# Altium project wifi_esp8266.PrjPcb
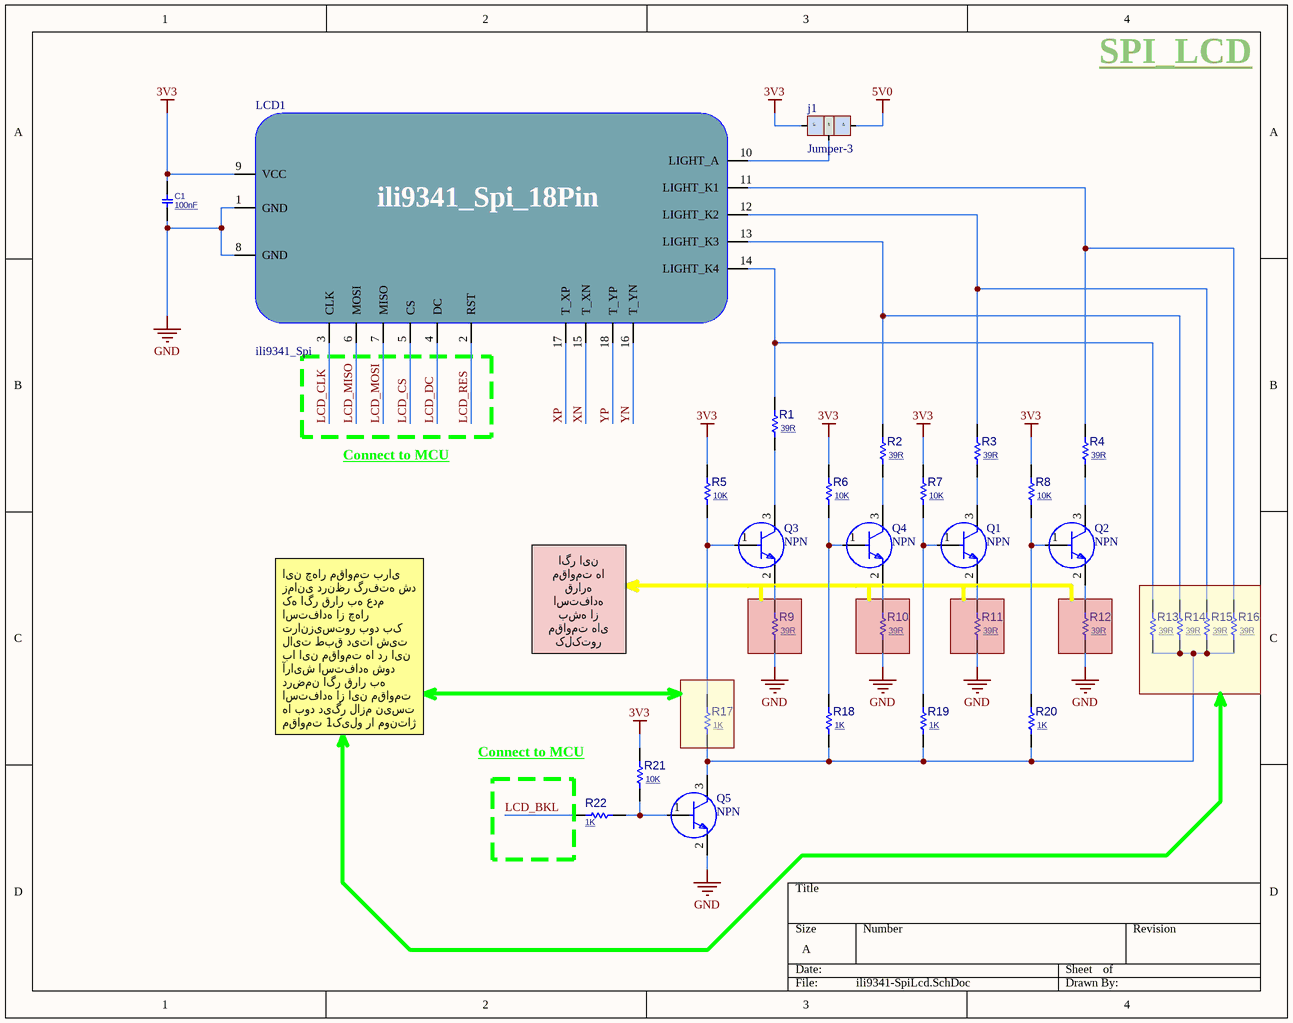
[diagram p0: ili9341-SpiLcd.SchDoc]
12 sheets, 178 parts. Net scope: global (net labels, ports and power ports of the same name join across sheets).
Board file: Stm32F411CEU6-wifi-btn-lcd.PcbDoc
Sheets:
  ili9341-SpiLcd.SchDoc
  Xpt2046.SchDoc
  W25Qxx-SpiFlash.SchDoc
  SDIO_SDcard.SchDoc
  AT24Cxxx_EEPROM_I2C.SchDoc
  ESP8266-12x.SchDoc
  HC-05_BlueTooth.SchDoc
  Key_LED_Buzzer.SchDoc
  Stm32F411CEU6.SchDoc
  Stm32F411CEU6_Property.SchDoc
  AMS1117-3.3V.SchDoc
  PCF8547.SchDoc

## Sheet ili9341-SpiLcd.SchDoc
size A; SheetNumber: 1; SheetTotal: 12

### Parts
C1  100nF  [C0603]
j1  Jumper-3  [jumper-3]
LCD1  ili9341_Spi  [ILI9341_Spi_18Pin_2]
Q1  NPN  [FP-SOT23-IPC_A]
Q2  NPN  [FP-SOT23-IPC_A]
Q3  NPN  [FP-SOT23-IPC_A]
Q4  NPN  [FP-SOT23-IPC_A]
Q5  NPN  [FP-SOT23-IPC_A]
R1  39R  [R0603]
R2  39R  [R0603]
R3  39R  [R0603]
R4  39R  [R0603]
R5  10K  [R0603]
R6  10K  [R0603]
R7  10K  [R0603]
R8  10K  [R0603]
R9  39R  [R0603]
R10  39R  [R0603]
R11  39R  [R0603]
R12  39R  [R0603]
R13  39R  [R0603]
R14  39R  [R0603]
R15  39R  [R0603]
R16  39R  [R0603]
R17  1K  [R0603]
R18  1K  [R0603]
R19  1K  [R0603]
R20  1K  [R0603]
R21  10K  [R0603]
R22  1K  [R0603]

### Nets
3V3: C1.2 j1.3 LCD1.9(VCC) R5.2 R6.2 R7.2 R8.2 R21.2
5V0: j1.1
GND: C1.1 LCD1.1(GND) LCD1.8(GND) Q5.2(E) R9.1 R10.1 R11.1 R12.1
LCD_BKL: R22.2
LCD_CLK: LCD1.3(CLK)
LCD_CS: LCD1.5(CS)
LCD_DC: LCD1.4(DC)
LCD_MISO: LCD1.6(MOSI)
LCD_MOSI: LCD1.7(MISO)
LCD_RES: LCD1.2(RST)
XN: LCD1.15(T_XN)
XP: LCD1.17(T_XP)
YN: LCD1.16(T_YN)
YP: LCD1.18(T_YP)
Netj1_2: j1.2 LCD1.10(LIGHT_A)
NetLCD1_11: LCD1.11(LIGHT_K1) R4.2 R16.2
NetLCD1_12: LCD1.12(LIGHT_K2) R3.2 R15.2
NetLCD1_13: LCD1.13(LIGHT_K3) R2.2 R14.2
NetLCD1_14: LCD1.14(LIGHT_K4) R1.2 R13.2
NetQ1_1: Q1.1(B) R7.1 R19.2
NetQ1_2: Q1.2(E) R11.2
NetQ1_3: Q1.3(C) R3.1
NetQ2_1: Q2.1(B) R8.1 R20.2
NetQ2_2: Q2.2(E) R12.2
NetQ2_3: Q2.3(C) R4.1
NetQ3_1: Q3.1(B) R5.1 R17.2
NetQ3_2: Q3.2(E) R9.2
NetQ3_3: Q3.3(C) R1.1
NetQ4_1: Q4.1(B) R6.1 R18.2
NetQ4_2: Q4.2(E) R10.2
NetQ4_3: Q4.3(C) R2.1
NetQ5_1: Q5.1(B) R21.1 R22.1
NetQ5_3: Q5.3(C) R13.1 R14.1 R15.1 R16.1 R17.1 R18.1 R19.1 R20.1

### Notes on the sheet
- SPI_LCD
- Connect to MCU
- اگر این مقاومت ها قراره استفاده بشه از مقاومت های کلکتور استفاده نمیکنیم
- این چهار مقاومت برای زمانی درنظر گرفته شد که اگر قرار به عدم استفاده از چهار ترانزیستور بود بک لایت طبق دیتا شیت با این مقاومت ها در این آرایش استفاده شود
  درضمن اگر قرار به استفاده از این مقاومت ها بود دیگر لازم نیست مقاومت 1کیلو را مونتاژ کرد
- (in symbol ili9341_Spi) ili9341_Spi_18Pin
- (in symbol Jumper-3) C; B; A

### Library data of the parts
C1 = CAP_SMD_MLCC_0603: CAP, MLCC, -F, -V, MATERIAL, -%, 0201; PARAM: -, -%; MANF_P#: MANF_PART#; PRICE: 100= 1$; MANF: -; PARAM2: -V; ASSEMBLY: ASSEMBLY; VALUE: 100nF
Q1-Q5 = CMP-2000-04931-2: Frequency: 300MHz; Collector Emitter Voltage (VCEO): 40V; Power Dissipation: 350mW; Element Configuration: Single; Max Power Dissipation: 300mW; Max Collector Current: 200mA; Collector Emitter Saturation Voltage: 300mV; Number of Elements: 1; hFE Min: 100; Collector Base Voltage (VCBO): 60V; Emitter Base Voltage (VEBO): 6V; Contact Plating: Tin; Package Quantity: 3000; Max Frequency: 300MHz; REACH SVHC: No SVHC; Max Operating Temperature: 150°C; Width: 1.4mm; Voltage Rating (DC): 40V; Radiation Hardening: No; Case/Package: SOT-23; Height: 1mm; Collector Emitter Breakdown Voltage: 40V; Length: 3.05mm; Polarity: NPN; Packaging: Tape and Reel; Number of Pins: 3; Min Operating Temperature: -55°C; Gain Bandwidth Product: 300MHz; Mount: Surface Mount; Weight: 0.000282oz; Continuous Collector Current: 200mA; Transition Frequency: 300MHz; Max Breakdown Voltage: 40V; Lead Free: Lead Free
R1-R22 = RES_SMD: RESISTOR, SMD; PARAM: -W; DESC: DESCRIPTION; DIST#: MOUSER; PARAM2: 1%; MANF_P#: -; MANF: -; ASSEMBLY: ASSEMBLY; PRICE: 100= 0.5$
  R1-R4 R9-R16: VALUE: 39R
  R5-R8 R21: VALUE: 10K
  R17-R20 R22: VALUE: 1K

## Sheet Xpt2046.SchDoc
size A; SheetNumber: 2; SheetTotal: 12
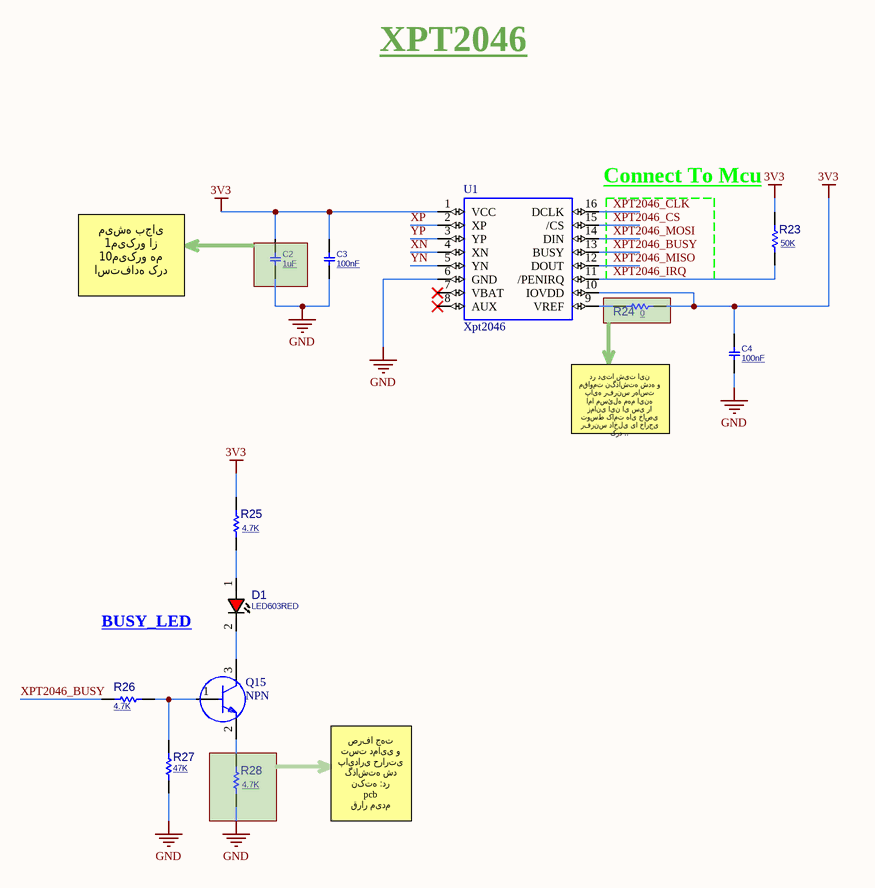
[diagram p1: Xpt2046.SchDoc]

### Parts
C2  1uF  [C1206]
C3  100nF  [C0603]
C4  100nF  [C0603]
D1  LED603RED  [LED0603RED]
Q15  NPN  [FP-SOT23-IPC_A]
R23  50K  [R0603]
R24  0  [R0603]
R25  4.7K  [R0603]
R26  4.7K  [R0603]
R27  47K  [R0603]
R28  4.7K  [R0603]
U1  Xpt2046  [Xpt2046]

### Nets
3V3: C2.2 C3.2 C4.2 R23.2 R24.1 R25.2 U1.1(VCC) U1.10(IOVDD)
GND: C2.1 C3.1 C4.1 R27.2 R28.1 U1.6(GND)
XN: U1.4(XN)
XP: U1.2(XP)
XPT2046_BUSY: R26.2 U1.13(BUSY)
XPT2046_CLK: U1.16(DCLK)  [project net W25Q_CLK]
XPT2046_CS: U1.15(/CS)
XPT2046_IRQ: R23.1 U1.11(/PENIRQ)
XPT2046_MISO: U1.12(DOUT)  [project net W25Q_MISO]
XPT2046_MOSI: U1.14(DIN)  [project net W25Q_MOSI]
YN: U1.5(YN)
YP: U1.3(YP)
NetD1_1: D1.1(ANODE) R25.1
NetD1_2: D1.2(CATHODE) Q15.3(C)
NetQ15_1: Q15.1(B) R26.1 R27.1
NetQ15_2: Q15.2(E) R28.2
NetR24_2: R24.2 U1.9(VREF)

Not connected (* = marked no-connect by the designer): U1 7(VBAT)* 8(AUX)*

### Notes on the sheet
- XPT2046
- Connect To Mcu
- میشه بجای 1میکرو از 10میکرو هم استفاده کرد
- در دیتا شیت این مقاومت نگذاشته شده و پایه رفرنس رهاست
  اما مسئله مهم اینه زمانی این ای سی را توسط کامت های خاصی رفرنس داخلی یا خارجی کرد ..
- BUSY_LED
- صرفا جهت تست دمایی و پایداری حرارتی گذاشته شد نکته :در
  pcb
  قرار میدم

### Library data of the parts
C2 = CAP_SMD_MLCC_1206: CAP, MLCC, -F, -V, MATERIAL, -%, 0201; PARAM: -, -%; MANF_P#: MANF_PART#; PRICE: 100= 1$; MANF: -; PARAM2: -V; ASSEMBLY: ASSEMBLY; VALUE: 1uF
C3 C4 = CAP_SMD_MLCC_0603: as C1 on sheet ili9341-SpiLcd; PRICE: 100= 1$; MANF: -; PARAM2: -V; ASSEMBLY: ASSEMBLY; VALUE: 100nF
D1 = LED_SMD_0603_RED: LED, SMD, 0603, RED; PARAM: 30mA, 640nm; DESC: DESCRIPTION; MANF_P#: MANF_PART#; PARAM2: 1.8~2.5V; MANF: MANF; ASSEMBLY: ASSEMBLY; PRICE: PRICE; VALUE: LED603RED
Q15 = CMP-2000-04931-2: as Q1 on sheet ili9341-SpiLcd; Contact Plating: Tin; Package Quantity: 3000; Max Frequency: 300MHz; REACH SVHC: No SVHC; Max Operating Temperature: 150°C; Width: 1.4mm; Voltage Rating (DC): 40V; Radiation Hardening: No; Case/Package: SOT-23; Height: 1mm; Collector Emitter Breakdown Voltage: 40V; Length: 3.05mm; Polarity: NPN; Packaging: Tape and Reel; Number of Pins: 3; Min Operating Temperature: -55°C; Gain Bandwidth Product: 300MHz; Mount: Surface Mount; Weight: 0.000282oz; Continuous Collector Current: 200mA; Transition Frequency: 300MHz; Max Breakdown Voltage: 40V; Lead Free: Lead Free
R23-R28 = RES_SMD: as R1 on sheet ili9341-SpiLcd; MANF_P#: -; MANF: -; ASSEMBLY: ASSEMBLY; PRICE: 100= 0.5$
  R23: VALUE: 50K
  R24: VALUE: 0
  R25 R26 R28: VALUE: 4.7K
  R27: VALUE: 47K

## Sheet W25Qxx-SpiFlash.SchDoc
size A; SheetNumber: 3; SheetTotal: 12
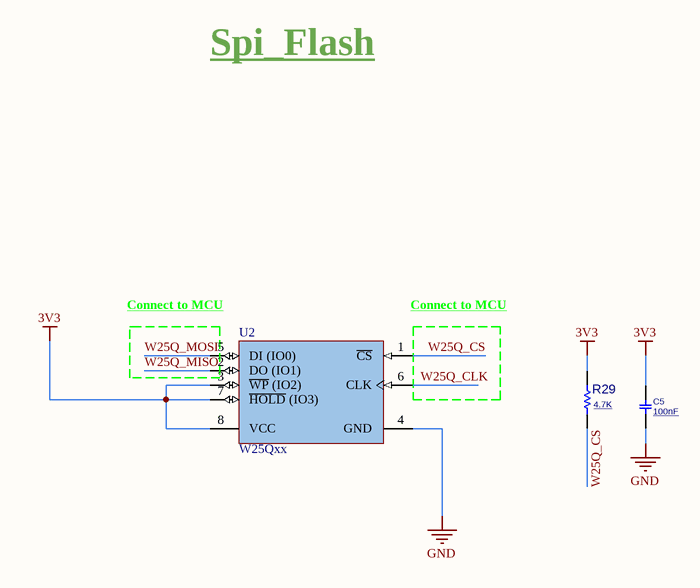
[diagram p2: W25Qxx-SpiFlash.SchDoc]

### Parts
C5  100nF  [C0603]
R29  4.7K  [R0603]
U2  W25Qxx  [WINB-SOIC-8_M]

### Nets
3V3: C5.2 R29.2 U2.3(~{WP}_(IO2)) U2.7(~{HOLD}_(IO3)) U2.8(VCC)
GND: C5.1 U2.4(GND)
W25Q_CLK: U2.6(CLK)
W25Q_CS: R29.1 U2.1(~{CS})
W25Q_MISO: U2.2(DO_(IO1))
W25Q_MOSI: U2.5(DI_(IO0))

### Notes on the sheet
- Spi_Flash
- (near U2) Connect to MCU

### Library data of the parts
C5 = CAP_SMD_MLCC_0603: as C1 on sheet ili9341-SpiLcd; PRICE: 100= 1$; MANF: -; PARAM2: -V; ASSEMBLY: ASSEMBLY; VALUE: 100nF
R29 = RES_SMD: as R1 on sheet ili9341-SpiLcd; MANF_P#: -; MANF: -; ASSEMBLY: ASSEMBLY; PRICE: 100= 0.5$; VALUE: 4.7K
U2 = W25Qxx: Manufacturer: Winbond; Boot Type: Bottom/Top; Word Size: 8b; Cell Type: NOR; Operating Supply Voltage (Min): 2.7V; Operating Supply Voltage (Max): 3.6V; Rad Hardened: No; Density: 67108864Bit; Address Bus: 1b; Supply Current: 40mA; Program/Erase Volt (Typ): 2.7to3.6V; Sync/Async: Synchronous; Number of Words: 8M; Programmable: Yes; Operating Supply Voltage (Typ): 3/3.3V; Access Time (Max): 8.5ns; Interface Type: Serial(SPI); Operating Temperature Classification: Industrial; Datasheet Version: Rev. D, 12/2011; Operating Temp Range: -40Cto85C; Operating Temperature (Max): 85C; Pin Count: 8; Mounting: SurfaceMount; Operating Temperature (Min): -40C; Package Description: 8-Pin Small Outline Integrated Circuit, Body 5.28 x 5.28 mm, Pitch 1.27 mm; Datasheet URL: https://datasheet.ciiva.com/15126/getdatasheetpartid-552937-15126648.pdf; Package Reference: SS-8; Manufacturer URL: http://www.winbond.com/hq/index.html?__locale=en; Package Type: SOIC

## Sheet SDIO_SDcard.SchDoc
size A; SheetNumber: 4; SheetTotal: 12
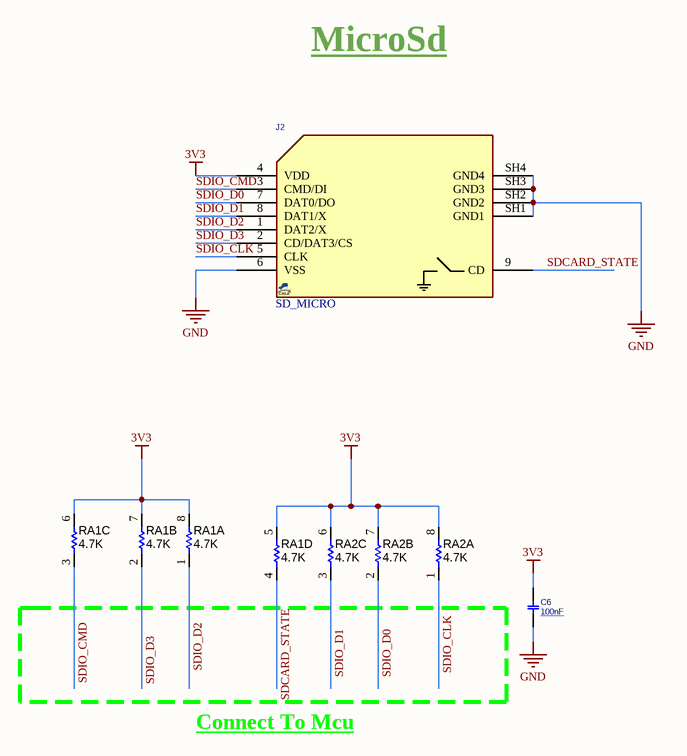
[diagram p3: SDIO_SDcard.SchDoc]

### Parts
C6  100nF  [C0603]
J2  SD_MICRO  [SDMICRO_AT]
RA1  value 4.7K  [RP0603X4]  (hidden comment: Film Res Pack)  (parts A,B,C,D of 4)
RA2  value 4.7K  [RP0603X4]  (hidden comment: Film Res Pack)  (parts A,B,C of 4)

### Nets
3V3: C6.2 J2.4(VDD) RA1.5 RA1.6 RA1.7 RA1.8 RA2.6 RA2.7 RA2.8
GND: C6.1 J2.6(VSS) J2.SH1(GND1) J2.SH2(GND2) J2.SH3(GND3) J2.SH4(GND4)
SDCARD_STATE: J2.9(CD) RA1.4
SDIO_CLK: J2.5(CLK) RA2.1
SDIO_CMD: J2.3(CMD/DI) RA1.3
SDIO_D0: J2.7(DAT0/DO) RA2.2
SDIO_D1: J2.8(DAT1/X) RA2.3
SDIO_D2: J2.1(DAT2/X) RA1.1
SDIO_D3: J2.2(CD/DAT3/CS) RA1.2

### Notes on the sheet
- MicroSd
- Connect To Mcu

### Library data of the parts
C6 = CAP_SMD_MLCC_0603: as C1 on sheet ili9341-SpiLcd; PRICE: 100= 1$; MANF: -; PARAM2: -V; ASSEMBLY: ASSEMBLY; VALUE: 100nF
J2 = SOCKET_SDMICRO_AT: SD MICRO exist in Iran, Attend 112J-TDAR-R01; PARAM: push-push; MANF: Attend; MANF_P#: 112J-TDAR-R01; VALUE: SD_MICRO
RA1 RA2 = RES_SMD_PACK_X4: RESISTOR, SMD, PACKX4; MANF_P#: MANF_PART#; MANF: MANF

## Sheet AT24Cxxx_EEPROM_I2C.SchDoc
size A; SheetNumber: 5; SheetTotal: 12
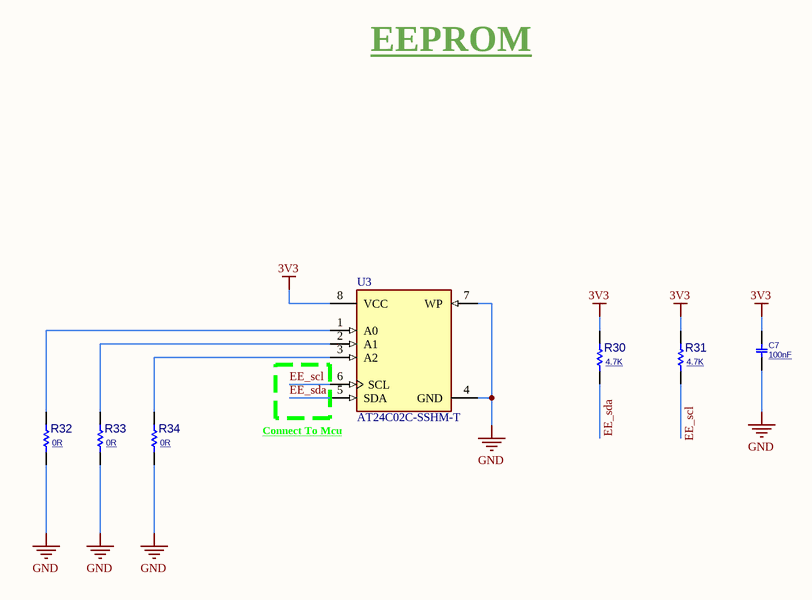
[diagram p4: AT24Cxxx_EEPROM_I2C.SchDoc]

### Parts
C7  100nF  [C0603]
R30  4.7K  [R0603]
R31  4.7K  [R0603]
R32  0R  [R0603]
R33  0R  [R0603]
R34  0R  [R0603]
U3  AT24C02C-SSHM-T  [FP-C04-057-SN-MFG]

### Nets
3V3: C7.2 R30.2 R31.2 U3.8(VCC)
GND: C7.1 R32.1 R33.1 R34.1 U3.4(GND) U3.7(WP)
EE_scl: R31.1 U3.6(SCL)
EE_sda: R30.1 U3.5(SDA)
NetR32_2: R32.2 U3.1(A0)
NetR33_2: R33.2 U3.2(A1)
NetR34_2: R34.2 U3.3(A2)

### Notes on the sheet
- EEPROM
- (near U3) Connect To Mcu

### Library data of the parts
C7 = CAP_SMD_MLCC_0603: as C1 on sheet ili9341-SpiLcd; PRICE: 100= 1$; MANF: -; PARAM2: -V; ASSEMBLY: ASSEMBLY; VALUE: 100nF
R30-R34 = RES_SMD: as R1 on sheet ili9341-SpiLcd; MANF_P#: -; MANF: -; ASSEMBLY: ASSEMBLY; PRICE: 100= 0.5$
  R30 R31: VALUE: 4.7K
  R32-R34: VALUE: 0R
U3 = CMP-06313-000008-1: IC EEPROM 2K I2C 1MHZ 8SOIC; Manufacturer: Microchip; Frequency: 1000kHz; Nominal Supply Current: 0.4-2mA; Min Supply Voltage: 1.7V; Standoff Height: 0.1mm; Access Time: 900ns; Memory Size: 2Kbits; Max Supply Voltage: 5.5V; Interface: I2C,2-Wire; Ipc Land Pattern Name: SOIC127P600X175-8; Octopart: https://octopart.com/at24c02c-sshm-t-microchip-77757935; Footprint Url: http://ww1.microchip.com/downloads/en/DeviceDoc/08L_SOIC_150_3dot9mm_SN_C04-00057e.pdf; Temperature Range High: +85°C; Height: 1.75mm; Package: C04-057-SN; RoHS: TRUE; Mouser Description: EEPROM Serial-2Wire 2K-bit 256 x 8 1.8V/2.5V/3.3V/5V Automotive 8-Pin SOIC T/R; Memory Type: EEPROM; Device Class L3: EEPROM; Device Class L2: Memory; ComponentLink2URL: http://ww1.microchip.com/downloads/en/DeviceDoc/AT24C01C-AT24C02C-I2C-Compatible-Two-Wire-Serial-EEPROM-1Kbit-2Kbit-20006111A.pdf; Digikey Description: IC EEPROM 2K I2C 1MHZ 8SOIC; Category: IC; Temperature: -40°C to +85°C; Lead Free: Yes; Manufacturer Part Number: AT24C02C-SSHM-T; ComponentLink2Description: Datasheet; Temperature Range Low: -40°C; Automotive: No; Device Class L1: Integrated Circuits (ICs)

## Sheet ESP8266-12x.SchDoc
size A4; SheetNumber: 6; SheetTotal: 12
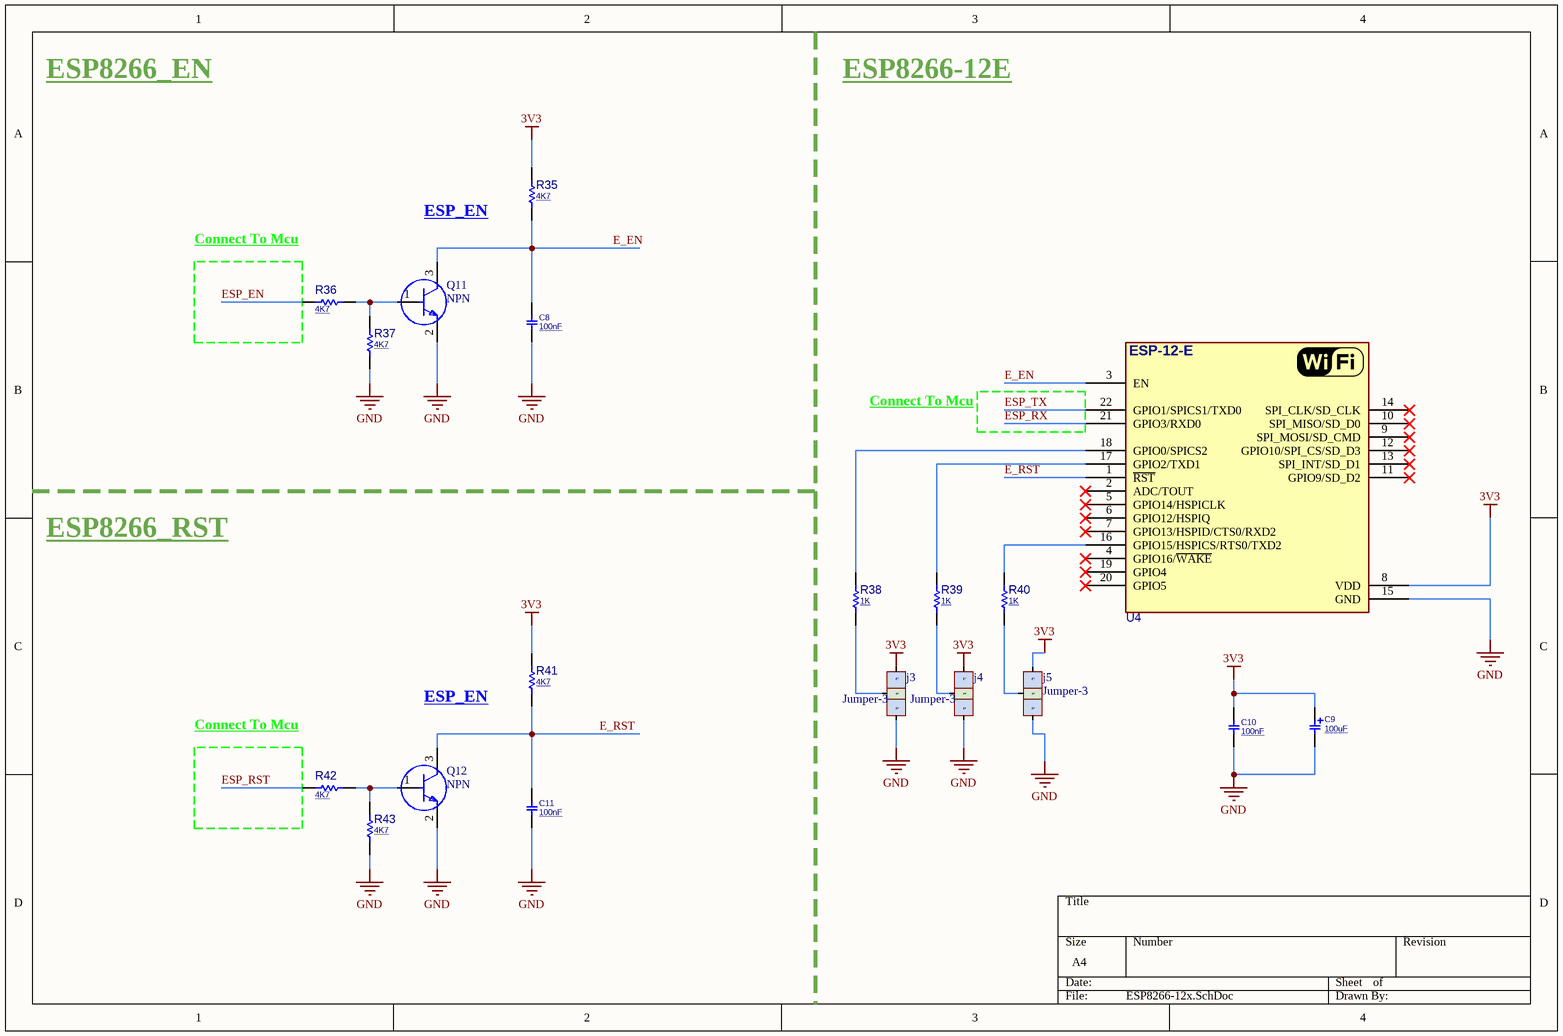
[diagram p5: ESP8266-12x.SchDoc]

### Parts
C8  100nF  [C0603]
C9  value 100uF  [C_TN_3216]  (hidden comment: 4.7uF)
C10  100nF  [C0603]
C11  100nF  [C0603]
j3  Jumper-3  [jumper-3]
j4  Jumper-3  [jumper-3]
j5  Jumper-3  [jumper-3]
Q11  NPN  [FP-SOT23-IPC_A]
Q12  NPN  [FP-SOT23-IPC_A]
R35  4K7  [R0603]
R36  4K7  [R0603]
R37  4K7  [R0603]
R38  1K  [R0603]
R39  1K  [R0603]
R40  1K  [R0603]
R41  4K7  [R0603]
R42  4K7  [R0603]
R43  4K7  [R0603]
U4  (no value)  [ESP8266_ESP12E]

### Nets
3V3: C9.1 C10.2 j3.3 j4.3 j5.3 R35.2 R41.2 U4.8(VDD)
GND: C8.1 C9.2 C10.1 C11.1 j3.1 j4.1 j5.1 Q11.2(E) Q12.2(E) R37.1 R43.1 U4.15(GND)
E_EN: C8.2 Q11.3(C) R35.1 U4.3(EN)
E_RST: C11.2 Q12.3(C) R41.1 U4.1(~{RST})
ESP_EN: R36.1
ESP_RST: R42.1
ESP_RX: U4.21(GPIO3/RXD0)
ESP_TX: U4.22(GPIO1/SPICS1/TXD0)
Netj3_2: j3.2 R38.1
Netj4_2: j4.2 R39.1
Netj5_2: j5.2 R40.1
NetQ11_1: Q11.1(B) R36.2 R37.2
NetQ12_1: Q12.1(B) R42.2 R43.2
NetR38_2: R38.2 U4.18(GPIO0/SPICS2)
NetR39_2: R39.2 U4.17(GPIO2/TXD1)
NetR40_2: R40.2 U4.16(GPIO15/HSPICS/RTS0/TXD2)

Not connected (* = marked no-connect by the designer): U4 2(ADC/TOUT)* 4(GPIO16/~{WAKE})* 5(GPIO14/HSPICLK)* 6(GPIO12/HSPIQ)* 7(GPIO13/HSPID/CTS0/RXD2)* 9(SPI_MOSI/SD_CMD)* 10(SPI_MISO/SD_D0)* 11(GPIO9/SD_D2)* 12(GPIO10/SPI_CS/SD_D3)* 13(SPI_INT/SD_D1)* 14(SPI_CLK/SD_CLK)* 19(GPIO4)* 20(GPIO5)*

### Notes on the sheet
- ESP8266_EN
- ESP8266-12E
- Connect To Mcu
- ESP_EN
- ESP8266_RST
- (in symbol ESP8266 ESP-12-E) ESP-12-E
- (in symbol Jumper-3) C; B; A

### Library data of the parts
C8 C10 C11 = CAP_SMD_MLCC_0603: as C1 on sheet ili9341-SpiLcd; PRICE: 100= 1$; MANF: -; PARAM2: -V; ASSEMBLY: ASSEMBLY; VALUE: 100nF
C9 = CAP_SMD_TAN_3216: CAP, SMD, TAN,; PARAM2: -V
Q11 Q12 = CMP-2000-04931-2: as Q1 on sheet ili9341-SpiLcd; Contact Plating: Tin; Package Quantity: 3000; Max Frequency: 300MHz; REACH SVHC: No SVHC; Max Operating Temperature: 150°C; Width: 1.4mm; Voltage Rating (DC): 40V; Radiation Hardening: No; Case/Package: SOT-23; Height: 1mm; Collector Emitter Breakdown Voltage: 40V; Length: 3.05mm; Polarity: NPN; Packaging: Tape and Reel; Number of Pins: 3; Min Operating Temperature: -55°C; Gain Bandwidth Product: 300MHz; Mount: Surface Mount; Weight: 0.000282oz; Continuous Collector Current: 200mA; Transition Frequency: 300MHz; Max Breakdown Voltage: 40V; Lead Free: Lead Free
R35-R43 = RES_SMD: as R1 on sheet ili9341-SpiLcd; MANF_P#: -; MANF: -; ASSEMBLY: ASSEMBLY; PRICE: 100= 0.5$
  R35-R37 R41-R43: VALUE: 4K7
  R38-R40: VALUE: 1K
U4 = ESP8266 ESP-12-E: ESP8266 ESP-12 Wi-Fi Module; ComponentLink1Description: Website Smart World; ComponentLink1URL: https://www.smartw.ir/; DatasheetVersion: 2021; ComponentLink2Description: Telegram; ComponentLink2URL: https://t.me/altium_smartw; ComponentLink3Description: Instagram; ComponentLink3URL: https://Instagram.com/smartgw.ir

## Sheet HC-05_BlueTooth.SchDoc
size A; SheetNumber: 7; SheetTotal: 12
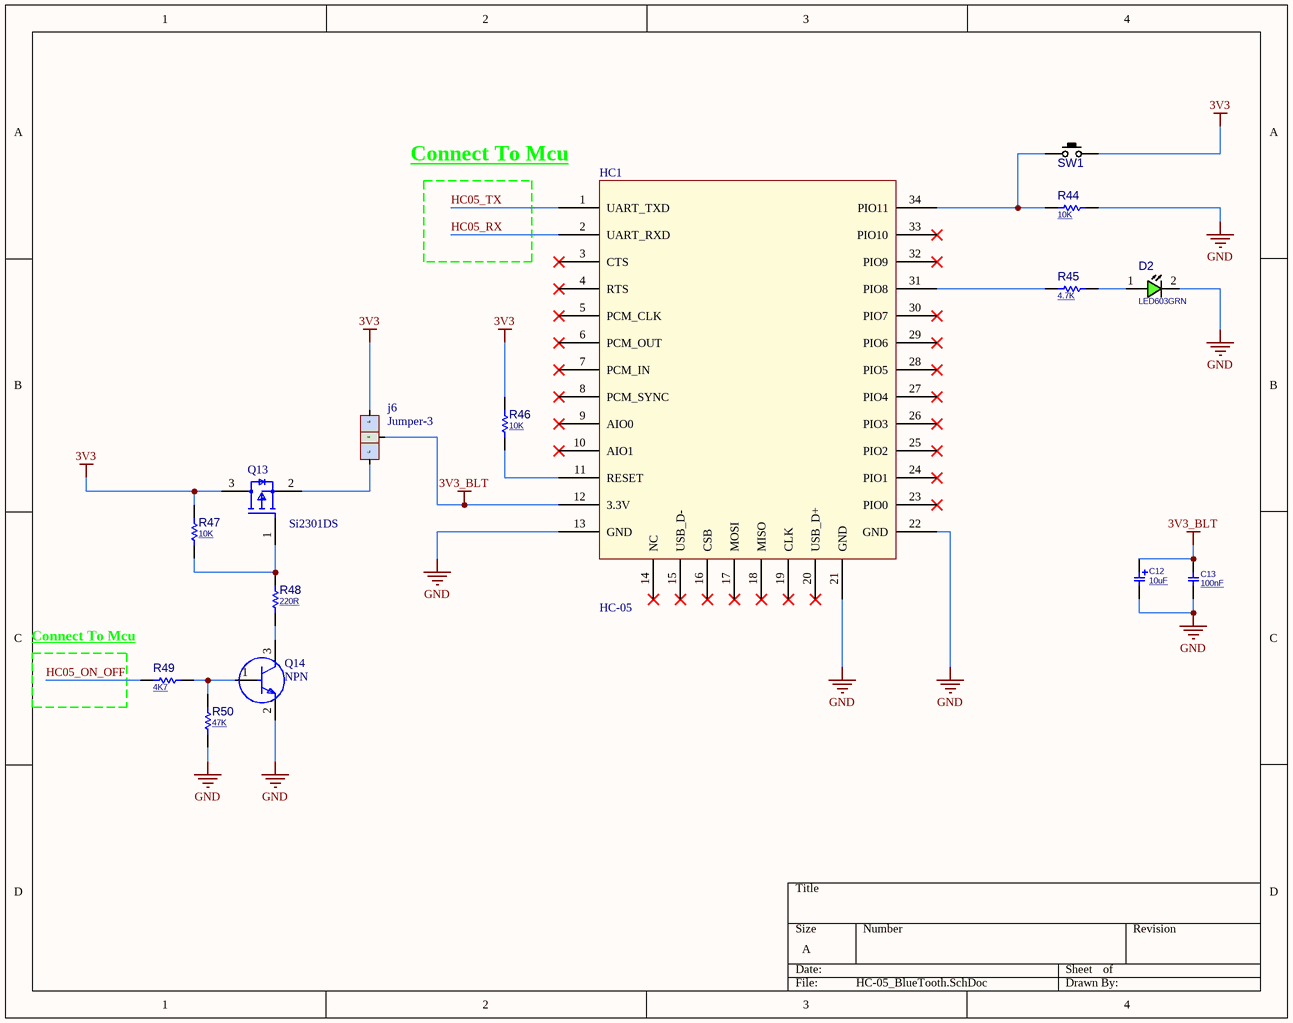
[diagram p6: HC-05_BlueTooth.SchDoc]

### Parts
C12  value 10uF  [C_TN_3216]  (hidden comment: 4.7uF)
C13  100nF  [C0603]
D2  LED603GRN  [LED0603GRN]
HC1  HC-05  [HC-05]
j6  Jumper-3  [jumper-3]
Q13  Si2301DS  [FP-S-03946-IPC_A]
Q14  NPN  [FP-SOT23-IPC_A]
R44  10K  [R0603]
R45  4.7K  [R0603]
R46  10K  [R0603]
R47  10K  [R0603]
R48  220R  [R0603]
R49  4K7  [R0603]
R50  47K  [R0603]
SW1  PUSHBUTTON  [SWPBS_SPST_6X3X5]  (value not drawn)

### Nets
3V3: j6.1 Q13.3(D) R46.1 R47.2 SW1.2(P3)
3V3_BLT: C12.1 C13.2 HC1.12(3.3V) j6.2
GND: C12.2 C13.1 D2.2(CATHODE) HC1.13(GND) HC1.21(GND) HC1.22(GND) Q14.2(E) R44.1 R50.1
HC05_ON_OFF: R49.1
HC05_RX: HC1.2(UART_RXD)
HC05_TX: HC1.1(UART_TXD)
NetD2_1: D2.1(ANODE) R45.1
NetHC1_11: HC1.11(RESET) R46.2
NetHC1_31: HC1.31(PIO8) R45.2
NetHC1_34: HC1.34(PIO11) R44.2 SW1.1(P1)
Netj6_3: j6.3 Q13.2(S)
NetQ13_1: Q13.1(G) R47.1 R48.2
NetQ14_1: Q14.1(B) R49.2 R50.2
NetQ14_3: Q14.3(C) R48.1

Not connected (* = marked no-connect by the designer): HC1 3(CTS)* 4(RTS)* 5(PCM_CLK)* 6(PCM_OUT)* 7(PCM_IN)* 8(PCM_SYNC)* 9(AIO0)* 10(AIO1)* 14(NC)* 15(USB_D-)* 16(CSB)* 17(MOSI)* 18(MISO)* 19(CLK)* 20(USB_D+)* 23(PIO0)* 24(PIO1)* 25(PIO2)* 26(PIO3)* 27(PIO4)* 28(PIO5)* 29(PIO6)* 30(PIO7)* 32(PIO9)* 33(PIO10)*

### Notes on the sheet
- Connect To Mcu
- (near R49) Connect To Mcu
- (in symbol Jumper-3) A; B; C

### Library data of the parts
C12 = CAP_SMD_TAN_3216: CAP, SMD, TAN,; PARAM2: -V
C13 = CAP_SMD_MLCC_0603: as C1 on sheet ili9341-SpiLcd; PRICE: 100= 1$; MANF: -; PARAM2: -V; ASSEMBLY: ASSEMBLY; VALUE: 100nF
D2 = LED_SMD_0603_GRN: LED, SMD, 0603, GREEN; PARAM: 20mA; MANF: Kingbright; DESC: DESCRIPTION; MANF_P#: APT1608SGC; PARAM2: 2.2V; ASSEMBLY: ASSEMBLY; PRICE: 1: 0.14$, 100: 6.8$; VALUE: LED603GRN
HC1 = HC-05: HC serial Bluetooth products consist of Bluetooth serial interface module and Bluetooth adapter, such; ComponentLink1Description: Website: Tarahiboard; ComponentLink1URL: https://www.tarahiboard.com/; ComponentLink2Description: Telegram; ComponentLink2URL: https://t.me/tarahiboard; ComponentLink3Description: Instagram; ComponentLink3URL: https://instagram.com/tarahiboard; DatasheetVersion: 2022
Q13 = Si2301DS: P-Channel 1.25-W, 2.5-V MOSFET; Manufacturer: Vishay; Manufacturer Part Number: SI2303CDS-T1-GE3; Max Forward Diode Voltage: -1.2V; Pulse Drain Current: -10A; Standoff Height: 0.01mm; Rthja Max: 120°C/W; Depletion Mode: False; Max Junction Temp: +150°C; Gate Charge At Vgs: 4nC @ -10V; Gate To Source Voltage: 20V; Drain To Source Voltage: -30V; Continuous Drain Current: -1.9A; Drain To Source Resistance: 0.158Ω; Reverse Recovery Charge: 9nC; Reverse Recovery Time: 17ns; Number Of Channels: 1; Typ Forward Diode Voltage: -0.8V; Power Dissipation: 1W; Turn Off Delay Time: 11ns; Input Capacitace At Vds: 155pF @ -15V; Transconductance: 2S; Turn On Delay Time: 4ns; Threshold Vgs Max: -3V; Threshold Vgs Min: -1V; Height: 1.12mm; Automotive: No; Device Class L1: Discrete Semiconductors; Digikey Description: MOSFET P-CH 30V 2.7A SOT23-3; Temperature Range Low: -55°C; Device Class L3: MOSFETs; Mouser Description: MOSFET 30V 2.7A 2.3W 190 mohms @ 10V; Octopart: https://octopart.com/si2303cds-t1-ge3-vishay-43171446; Drain To Source Breakdown Voltage: -30V; Device Class L2: Transistors; Package: S-03946; ComponentLink2Description: Datasheet; Ipc Land Pattern Name: SOT95P237X100-3; ComponentLink2URL: http://www.vishay.com/docs/69991/si2303cd.pdf; Number Of P Channels: 1; Temperature Range High: +150°C; Category: Trans; Lead Free: Yes; RoHS: TRUE; Temperature: -55°C to +150°C
Q14 = CMP-2000-04931-2: as Q1 on sheet ili9341-SpiLcd; Contact Plating: Tin; Package Quantity: 3000; Max Frequency: 300MHz; REACH SVHC: No SVHC; Max Operating Temperature: 150°C; Width: 1.4mm; Voltage Rating (DC): 40V; Radiation Hardening: No; Case/Package: SOT-23; Height: 1mm; Collector Emitter Breakdown Voltage: 40V; Length: 3.05mm; Polarity: NPN; Packaging: Tape and Reel; Number of Pins: 3; Min Operating Temperature: -55°C; Gain Bandwidth Product: 300MHz; Mount: Surface Mount; Weight: 0.000282oz; Continuous Collector Current: 200mA; Transition Frequency: 300MHz; Max Breakdown Voltage: 40V; Lead Free: Lead Free
R44-R50 = RES_SMD: as R1 on sheet ili9341-SpiLcd; MANF_P#: -; MANF: -; ASSEMBLY: ASSEMBLY; PRICE: 100= 0.5$
  R44 R46 R47: VALUE: 10K
  R45: VALUE: 4.7K
  R48: VALUE: 220R
  R49: VALUE: 4K7
  R50: VALUE: 47K
SW1 = SWPBS_SPST_6X3X5: SWITCH, PUSH BUTTON, TACTILE, SMD, SPST, 6X3.5X5mm; MANF: ALPS; DESC: DESCRIPTION; MANF_P#: SKQMBBE010; VALUE: PUSHBUTTON; ASSEMBLY: ASSEMBLY; PARAM: PARAM; PRICE: PRICE

## Sheet Key_LED_Buzzer.SchDoc
size A3; SheetNumber: 8; SheetTotal: 12
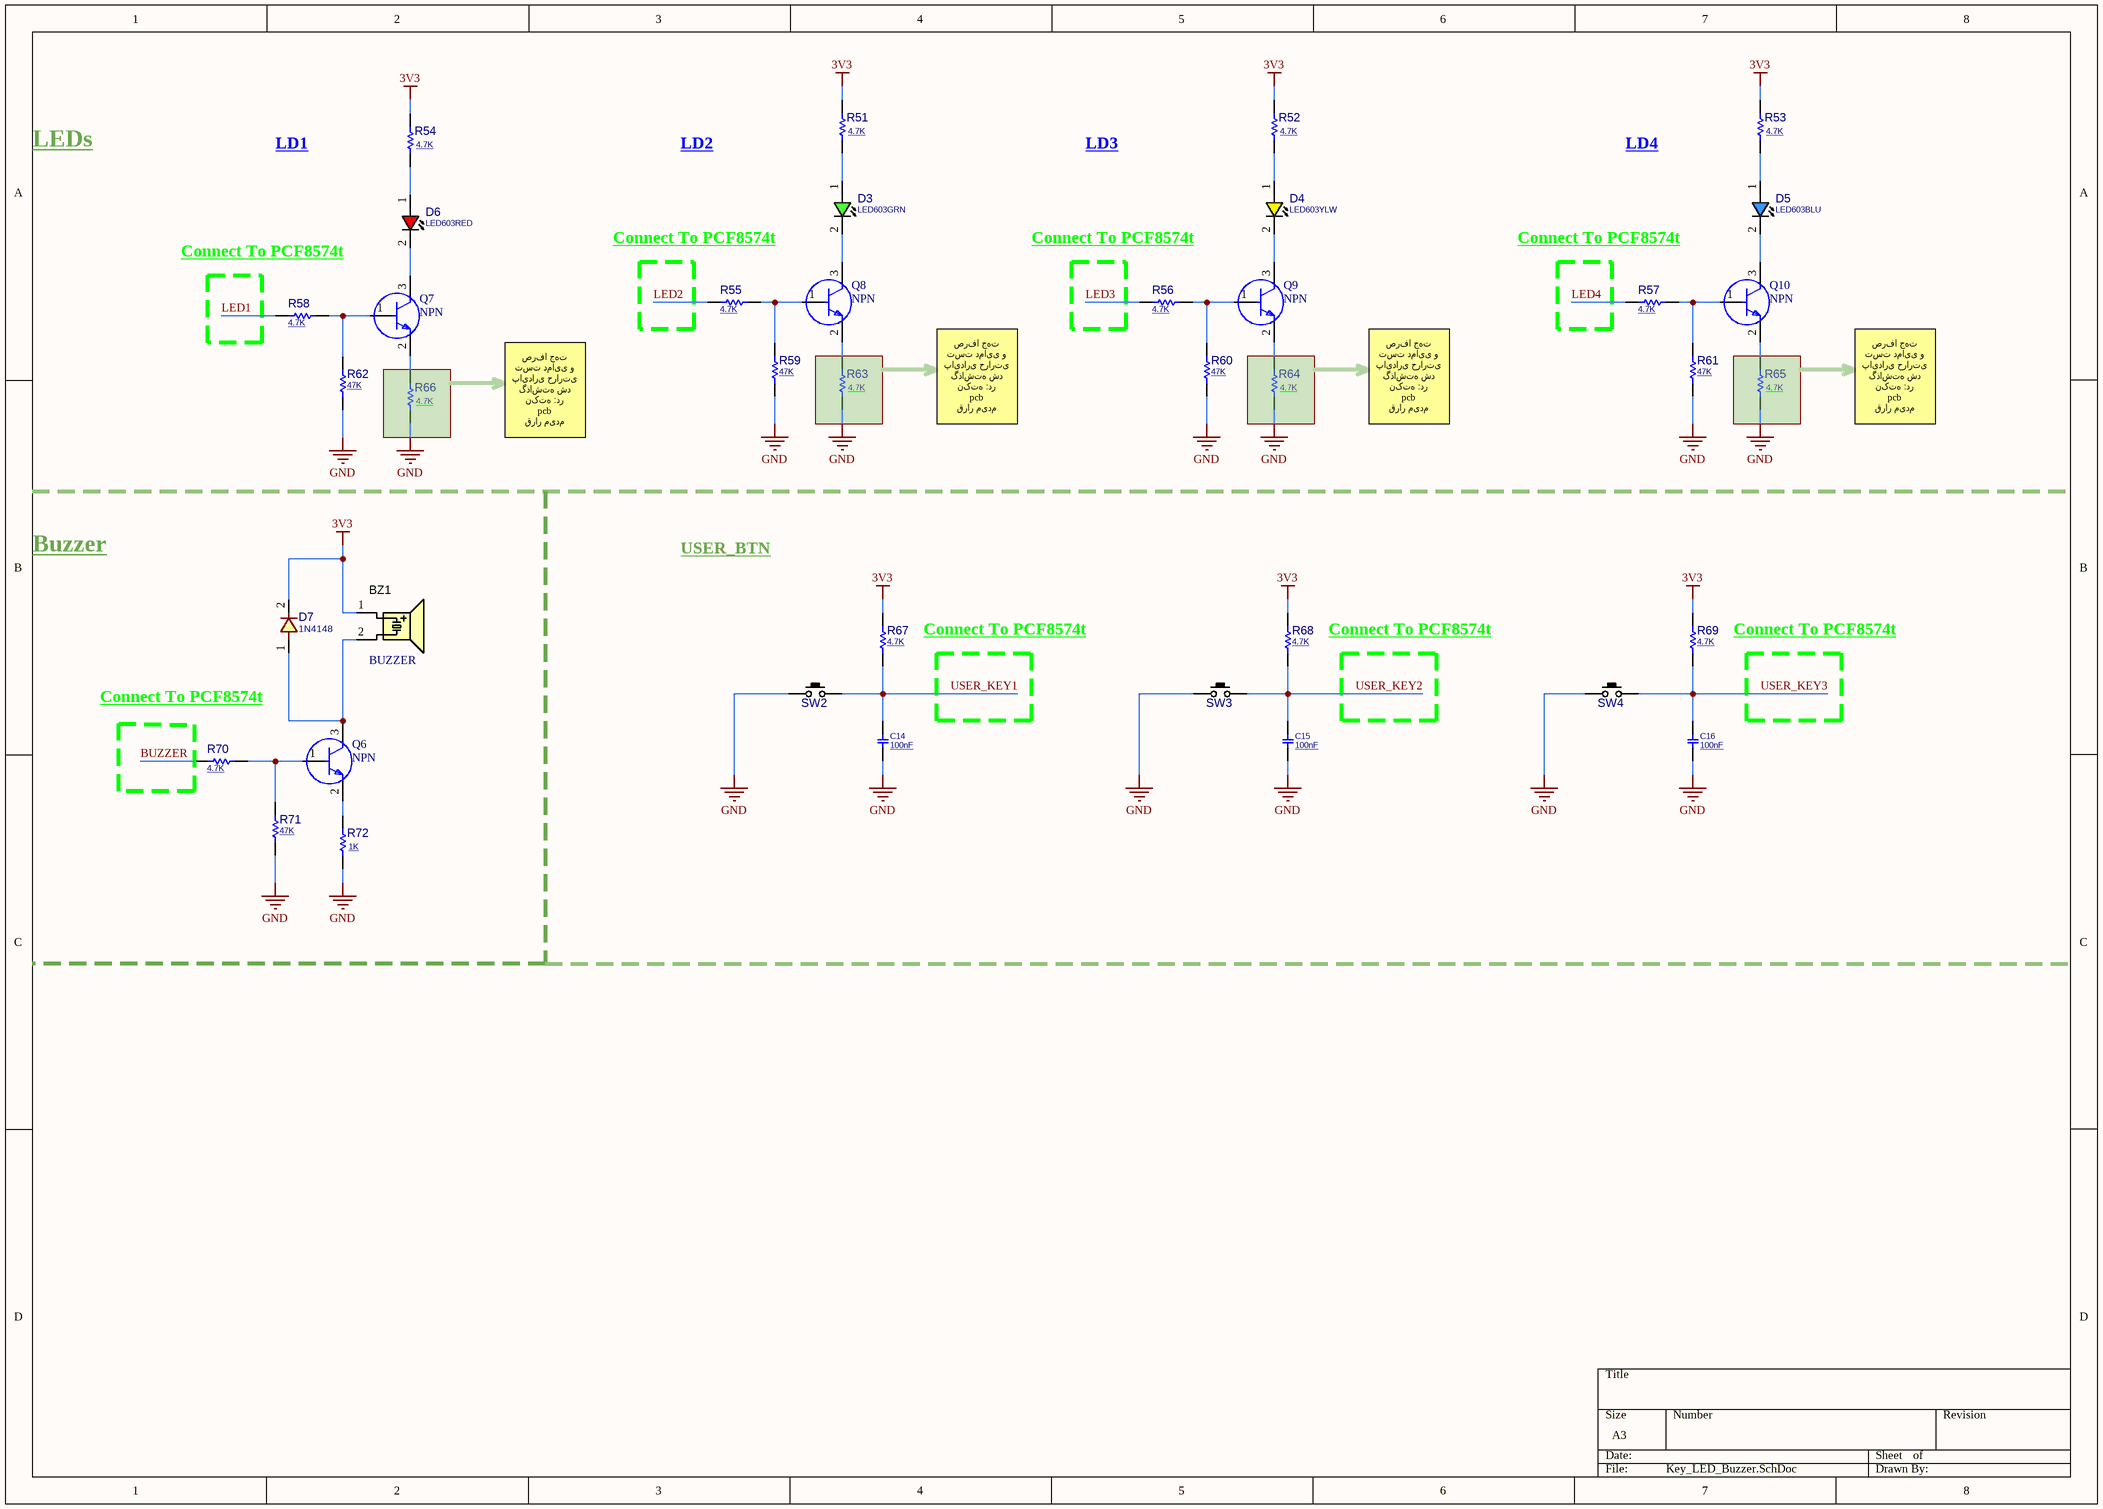
[diagram p7: Key_LED_Buzzer.SchDoc]

### Parts
BZ1  BUZZER  [BZ_SMD_S8]
C14  100nF  [C0603]
C15  100nF  [C0603]
C16  100nF  [C0603]
D3  LED603GRN  [LED0603GRN]
D4  LED603YLW  [LED0603YLW]
D5  LED603BLU  [LED0603BLU]
D6  LED603RED  [LED0603RED]
D7  1N4148  [D_SOD80]
Q6  NPN  [FP-SOT23-IPC_A]
Q7  NPN  [FP-SOT23-IPC_A]
Q8  NPN  [FP-SOT23-IPC_A]
Q9  NPN  [FP-SOT23-IPC_A]
Q10  NPN  [FP-SOT23-IPC_A]
R51  4.7K  [R0603]
R52  4.7K  [R0603]
R53  4.7K  [R0603]
R54  4.7K  [R0603]
R55  4.7K  [R0603]
R56  4.7K  [R0603]
R57  4.7K  [R0603]
R58  4.7K  [R0603]
R59  47K  [R0603]
R60  47K  [R0603]
R61  47K  [R0603]
R62  47K  [R0603]
R63  4.7K  [R0603]
R64  4.7K  [R0603]
R65  4.7K  [R0603]
R66  4.7K  [R0603]
R67  4.7K  [R0603]
R68  4.7K  [R0603]
R69  4.7K  [R0603]
R70  4.7K  [R0603]
R71  47K  [R0603]
R72  1K  [R0603]
SW2  PUSHBUTTON  [SWPBS_SPST_6X3X5]  (value not drawn)
SW3  PUSHBUTTON  [SWPBS_SPST_6X3X5]  (value not drawn)
SW4  PUSHBUTTON  [SWPBS_SPST_6X3X5]  (value not drawn)

### Nets
3V3: BZ1.1(A) D7.2 R51.2 R52.2 R53.2 R54.2 R67.1 R68.1 R69.1
GND: C14.1 C15.1 C16.1 R59.2 R60.2 R61.2 R62.2 R63.1 R64.1 R65.1 R66.1 R71.2 R72.1 SW2.1(P1) SW3.1(P1) SW4.1(P1)
BUZZER: R70.2
LED1: R58.2
LED2: R55.2
LED3: R56.2
LED4: R57.2
USER_KEY1: C14.2 R67.2 SW2.2(P3)
USER_KEY2: C15.2 R68.2 SW3.2(P3)
USER_KEY3: C16.2 R69.2 SW4.2(P3)
NetBZ1_2: BZ1.2(B) D7.1 Q6.3(C)
NetD3_1: D3.1(ANODE) R51.1
NetD3_2: D3.2(CATHODE) Q8.3(C)
NetD4_1: D4.1(ANODE) R52.1
NetD4_2: D4.2(CATHODE) Q9.3(C)
NetD5_1: D5.1(ANODE) R53.1
NetD5_2: D5.2(CATHODE) Q10.3(C)
NetD6_1: D6.1(ANODE) R54.1
NetD6_2: D6.2(CATHODE) Q7.3(C)
NetQ6_1: Q6.1(B) R70.1 R71.1
NetQ6_2: Q6.2(E) R72.2
NetQ7_1: Q7.1(B) R58.1 R62.1
NetQ7_2: Q7.2(E) R66.2
NetQ8_1: Q8.1(B) R55.1 R59.1
NetQ8_2: Q8.2(E) R63.2
NetQ9_1: Q9.1(B) R56.1 R60.1
NetQ9_2: Q9.2(E) R64.2
NetQ10_1: Q10.1(B) R57.1 R61.1
NetQ10_2: Q10.2(E) R65.2

### Notes on the sheet
- LEDs
- LD1
- LD2
- LD3
- LD4
- Connect To PCF8574t
- صرفا جهت تست دمایی و پایداری حرارتی گذاشته شد نکته :در
  pcb
  قرار میدم
- Buzzer
- USER_BTN
- (near R67) Connect To PCF8574t
- (near R68) Connect To PCF8574t
- (near R69) Connect To PCF8574t

### Library data of the parts
BZ1 = BZ_SMD_8X8X3: Buzzer, SMD, sealed 8.5x8.5x3mm LWH , 3Vp; PARAM: 2700 Hz, Magnetic; PARAM2: 2.7kHz, 85dBA @ 10cm; MANF: cre-sound; MANF_P#: LET8530BS-03L-2.7-16-R; PRICE: 2t@Javan; Value: BUZZER
C14-C16 = CAP_SMD_MLCC_0603: as C1 on sheet ili9341-SpiLcd; PRICE: 100= 1$; MANF: -; PARAM2: -V; ASSEMBLY: ASSEMBLY; VALUE: 100nF
D3 = LED_SMD_0603_GRN: as D2 on sheet HC-05_BlueTooth; ASSEMBLY: ASSEMBLY; PRICE: 1: 0.14$, 100: 6.8$; VALUE: LED603GRN
D4 = LED_SMD_0603_YLW: LED, SMD, 0603, YELLOW; DESC: DESCRIPTION; MANF_P#: MANF_PART#; PARAM2: 2.2V; MANF: MANF; ASSEMBLY: ASSEMBLY; PRICE: PRICE; VALUE: LED603YLW
D5 = LED_SMD_0603_BLU: LED, SMD, 0603, BLUE; PARAM: 30mA, 470nm, 120° Angle; DESC: DESCRIPTION; MANF_P#: MANF_PART#; PARAM2: 2.2~3V; MANF: MANF; ASSEMBLY: ASSEMBLY; PRICE: PRICE; VALUE: LED603BLU
D6 = LED_SMD_0603_RED: as D1 on sheet Xpt2046; MANF: MANF; ASSEMBLY: ASSEMBLY; PRICE: PRICE; VALUE: LED603RED
D7 = DIODE_SMD_1N4148_SOD80: DIODE, FAST SWTICHING, 0.3A, 0.5W; DESC: DESCRIPTION; PARAM: 75V; PARAM2: 300mA, 0.5W; MANF: MANF; ASSEMBLY: ASSEMBLY; PRICE: PRICE; MANF_P#: 1N4148; VALUE: 1N4148
Q6-Q10 = CMP-2000-04931-2: as Q1 on sheet ili9341-SpiLcd; Contact Plating: Tin; Package Quantity: 3000; Max Frequency: 300MHz; REACH SVHC: No SVHC; Max Operating Temperature: 150°C; Width: 1.4mm; Voltage Rating (DC): 40V; Radiation Hardening: No; Case/Package: SOT-23; Height: 1mm; Collector Emitter Breakdown Voltage: 40V; Length: 3.05mm; Polarity: NPN; Packaging: Tape and Reel; Number of Pins: 3; Min Operating Temperature: -55°C; Gain Bandwidth Product: 300MHz; Mount: Surface Mount; Weight: 0.000282oz; Continuous Collector Current: 200mA; Transition Frequency: 300MHz; Max Breakdown Voltage: 40V; Lead Free: Lead Free
R51-R72 = RES_SMD: as R1 on sheet ili9341-SpiLcd; MANF_P#: -; MANF: -; ASSEMBLY: ASSEMBLY; PRICE: 100= 0.5$
  R51-R58 R63-R70: VALUE: 4.7K
  R59-R62 R71: VALUE: 47K
  R72: VALUE: 1K
SW2-SW4 = SWPBS_SPST_6X3X5: as SW1 on sheet HC-05_BlueTooth; VALUE: PUSHBUTTON; ASSEMBLY: ASSEMBLY; PARAM: PARAM; PRICE: PRICE

## Sheet Stm32F411CEU6.SchDoc
size A; SheetNumber: 9; SheetTotal: 12
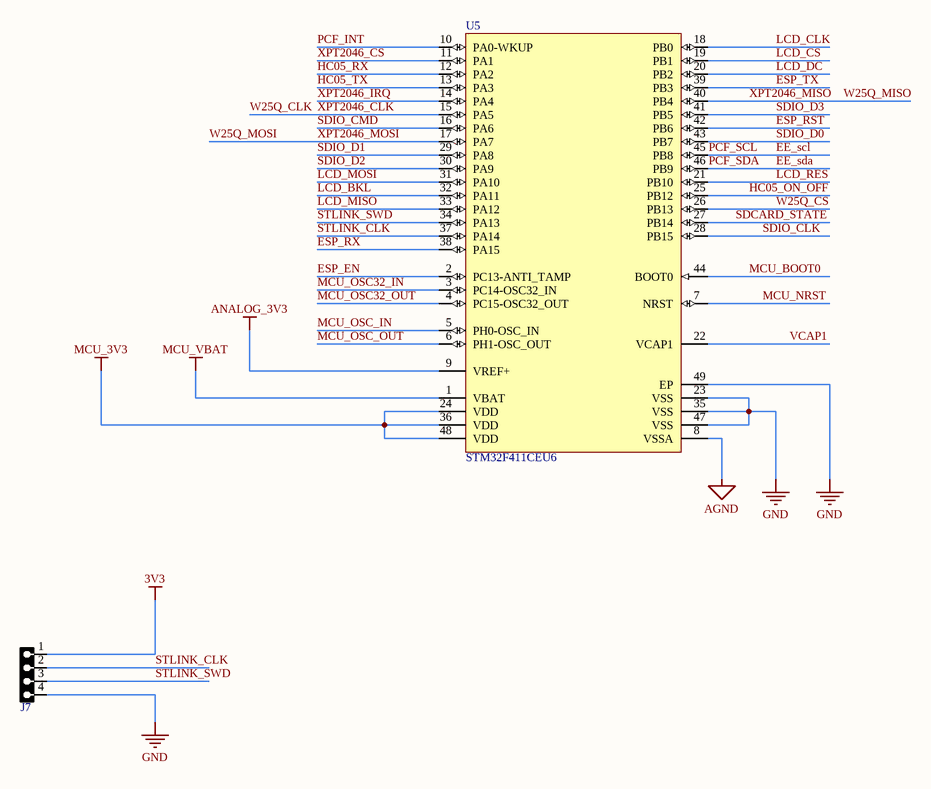
[diagram p8: Stm32F411CEU6.SchDoc]

### Parts
J7  HDRF4  [HDRSE_F_1X4]  (value not drawn)
U5  STM32F411CEU6  [STM-UFQFPN48_M]

### Nets
3V3: J7.1
AGND: U5.8(VSSA)
ANALOG_3V3: U5.9(VREF+)
GND: J7.4 U5.23(VSS) U5.35(VSS) U5.47(VSS) U5.49(EP)
MCU_3V3: U5.24(VDD) U5.36(VDD) U5.48(VDD)
MCU_VBAT: U5.1(VBAT)
EE_scl: U5.45(PB8)  [also labelled PCF_SCL]
EE_sda: U5.46(PB9)  [also labelled PCF_SDA]
ESP_EN: U5.2(PC13-ANTI_TAMP)
ESP_RST: U5.42(PB6)
ESP_RX: U5.38(PA15)
ESP_TX: U5.39(PB3)
HC05_ON_OFF: U5.25(PB12)
HC05_RX: U5.12(PA2)
HC05_TX: U5.13(PA3)
LCD_BKL: U5.32(PA11)
LCD_CLK: U5.18(PB0)
LCD_CS: U5.19(PB1)
LCD_DC: U5.20(PB2)
LCD_MISO: U5.33(PA12)
LCD_MOSI: U5.31(PA10)
LCD_RES: U5.21(PB10)
MCU_BOOT0: U5.44(BOOT0)
MCU_NRST: U5.7(NRST)
MCU_OSC32_IN: U5.3(PC14-OSC32_IN)
MCU_OSC32_OUT: U5.4(PC15-OSC32_OUT)
MCU_OSC_IN: U5.5(PH0-OSC_IN)
MCU_OSC_OUT: U5.6(PH1-OSC_OUT)
PCF_INT: U5.10(PA0-WKUP)
SDCARD_STATE: U5.27(PB14)
SDIO_CLK: U5.28(PB15)
SDIO_CMD: U5.16(PA6)
SDIO_D0: U5.43(PB7)
SDIO_D1: U5.29(PA8)
SDIO_D2: U5.30(PA9)
SDIO_D3: U5.41(PB5)
STLINK_CLK: J7.2 U5.37(PA14)
STLINK_SWD: J7.3 U5.34(PA13)
VCAP1: U5.22(VCAP1)
W25Q_CLK: U5.15(PA5)  [also labelled XPT2046_CLK]
W25Q_CS: U5.26(PB13)
W25Q_MISO: U5.40(PB4)  [also labelled XPT2046_MISO]
W25Q_MOSI: U5.17(PA7)  [also labelled XPT2046_MOSI]
XPT2046_CS: U5.11(PA1)
XPT2046_IRQ: U5.14(PA4)

### Library data of the parts
J7 = HDRSE_F_1X4: CONN, HEADER, Female, pitch: 2.54mm, 4POS; VALUE: HDRF4
U5 = CMP-0243-00165-1: ARM Cortex-M4 32-bit MCU+FPU, 512 KB Flash, 128 KB RAM, 36 I/Os, 48-Pin UFQFPN, -40 to 85 degC, Tray; Operating Frequency(F) (Processor speed) (MHz): 100; FLASH Size (Prog) (kB): 512; Internal RAM Size (kB): 128; I/Os (High Current): 36; Supply Voltage(Vcc) min (V): 1.7; Package Reference: 48-Pin Ultra Thin Fine Pitch Quad Flat No-Lead, 7 x 7 x 0.6 mm Body, 0.5 mm Pitch, Exposed Pad; ComponentLink1Description: Manufacturer URL; ComponentLink1URL: http://www.st.com/; Packing: Tray; Package Description: UFQFPN48; Core: ARM Cortex-M4; ComponentLink2Description: Datasheet; ComponentLink2URL: http://www.st.com/st-web-ui/static/active/en/resource/technical/document/datasheet/DM00115249.pdf; DatasheetVersion: Rev. 6; Mounting Technology: Surface Mount

## Sheet Stm32F411CEU6_Property.SchDoc
size A; SheetNumber: 10; SheetTotal: 12
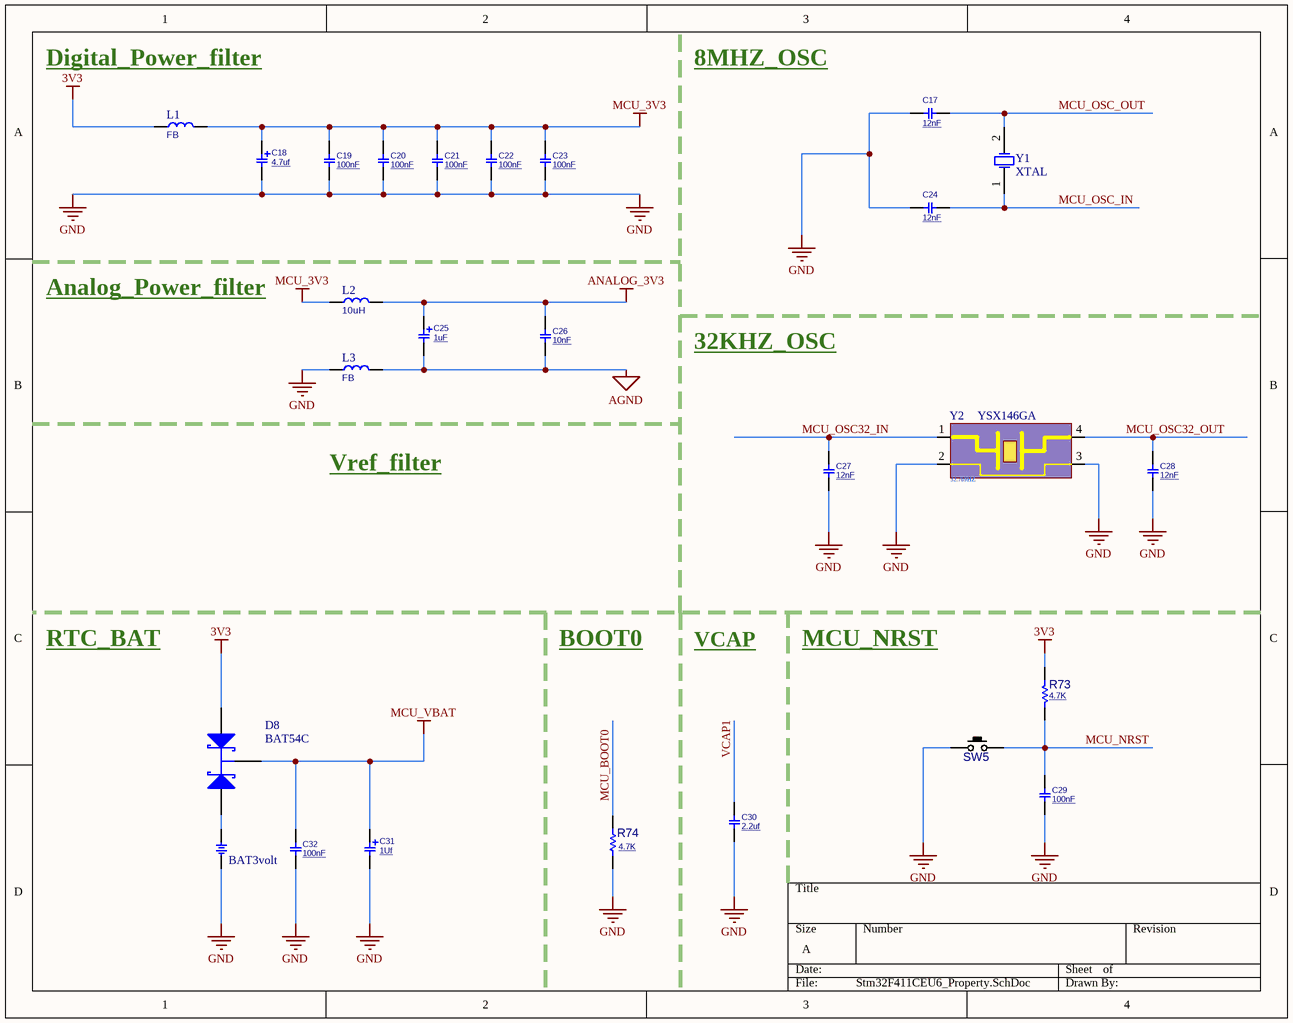
[diagram p9: Stm32F411CEU6_Property.SchDoc]

### Parts
BT1  BAT3volt  [BTH1220]
C17  12nF  [C0603]
C18  4.7uF  [C_TN_3216]
C19  100nF  [C0603]
C20  100nF  [C0603]
C21  100nF  [C0603]
C22  100nF  [C0603]
C23  100nF  [C0603]
C24  12nF  [C0603]
C25  value 1uF  [C_TN_3216]  (hidden comment: 4.7uF)
C26  10nF  [C0603]
C27  12nF  [C0603]
C28  12nF  [C0603]
C29  100nF  [C0603]
C30  2.2uf  [C0603]
C31  value 1Uf  [C_TN_3216]  (hidden comment: 4.7uF)
C32  100nF  [C0603]
D8  BAT54C  [NXP-SOT23-3_V]
L1  FB  [L0805]
L2  10uH  [L1210A]
L3  FB  [L0805]
R73  4.7K  [R0603]
R74  4.7K  [R0603]
SW5  PUSHBUTTON  [SWPBS_SPST_6X3X5]  (value not drawn)
Y1  XTAL  [XTL_2_5032]
Y2  YSX146GA  [YSX146GA-32.768xTAL]

### Nets
3V3: D8.1(A) L1.1 R73.2
AGND: C25.2 C26.1 L3.2
ANALOG_3V3: C25.1 C26.2 L2.2
GND: BT1.2 C17.2 C18.2 C19.1 C20.1 C21.1 C22.1 C23.1 C24.2 C27.2 C28.2 C29.1 C30.1 C31.2 C32.1 L3.1 R74.1 SW5.1(P1) Y2.2 Y2.3
MCU_3V3: C18.1 C19.2 C20.2 C21.2 C22.2 C23.2 L1.2 L2.1
MCU_VBAT: C31.1 C32.2 D8.3(K)
MCU_BOOT0: R74.2
MCU_NRST: C29.2 R73.1 SW5.2(P3)
MCU_OSC32_IN: C27.1 Y2.1
MCU_OSC32_OUT: C28.1 Y2.4
MCU_OSC_IN: C24.1 Y1.1(OSC1)
MCU_OSC_OUT: C17.1 Y1.2(OSC2)
VCAP1: C30.2
NetBT1_1: BT1.1 D8.2(A)

### Notes on the sheet
- Digital_Power_filter
- 8MHZ_OSC
- Analog_Power_filter
- 32KHZ_OSC
- Vref_filter
- RTC_BAT
- BOOT0
- VCAP
- MCU_NRST
- (in symbol YSX146GA) 32.769HZ

### Library data of the parts
BT1 = BATH_CR1220: BATTERY HOLDER, CR1220; MANF_P#: -; .: http://www.chila.ir; VALUE: BAT3volt
C17 C19-C24 C26-C30 C32 = CAP_SMD_MLCC_0603: as C1 on sheet ili9341-SpiLcd; PRICE: 100= 1$; MANF: -; PARAM2: -V; ASSEMBLY: ASSEMBLY
  C17 C24 C27 C28: VALUE: 12nF
  C19-C23 C29 C32: VALUE: 100nF
  C26: VALUE: 10nF
  C30: VALUE: 2.2uf
C18 C25 C31 = CAP_SMD_TAN_3216: CAP, SMD, TAN,; PARAM2: -V
  C18: VALUE: 4.7uf
D8 = CMP-0417-00003-1: Schottky Barrier Diode, 30 V, 2 uA, -55 to 150 degC, 3-Pin SOT23, RoHS, Tape and Reel; Manufacturer: NXP Semiconductors; IR (uA): 2; VF (mV): 800; Trr (ns): 5; Cd (pF): 10; VR (V): 30; Rth(j-a) (K/W): 500; RoHS: TRUE; Packing: Tape and Reel; ComponentLink2URL: http://www.nxp.com/documents/data_sheet/BAT54_SER.pdf; PartNumber: BAT54C; ComponentLink2Description: Datasheet; Temperature Range: -55 to 150 degC; PackageReference: SOT23-3; PackageDescription: 3-Pin Plastic Surface-mounted Package, Body 1.3 x 2.9 mm, Pitch 0.95 mm; Mounting Technology: Surface Mount; ComponentLink1URL: http://www.nxp.com/; DatasheetVersion: Rev. 5; ComponentLink1Description: Manufacturer URL
L1-L3 = IND_SMD: INDUCTOR, SMD
  L1 L3: VALUE: FB
  L2: VALUE: 10uH
R73 R74 = RES_SMD: as R1 on sheet ili9341-SpiLcd; MANF_P#: -; MANF: -; ASSEMBLY: ASSEMBLY; PRICE: 100= 0.5$; VALUE: 4.7K
SW5 = SWPBS_SPST_6X3X5: as SW1 on sheet HC-05_BlueTooth; VALUE: PUSHBUTTON; ASSEMBLY: ASSEMBLY; PARAM: PARAM; PRICE: PRICE
Y1 = XTAL: Crystal Oscillator; Published: 8-Jun-2000; LatestRevisionDate: 17-Jul-2002; LatestRevisionNote: Re-released for DXP Platform.; PackageReference: R38; Publisher: Altium Limited; PackageDescription: Crystal, Thru-Hole; 2 Leads; Body 3.1 x 8.2 mm (Dia.xH)

## Sheet AMS1117-3.3V.SchDoc
size A; SheetNumber: 11; SheetTotal: 12
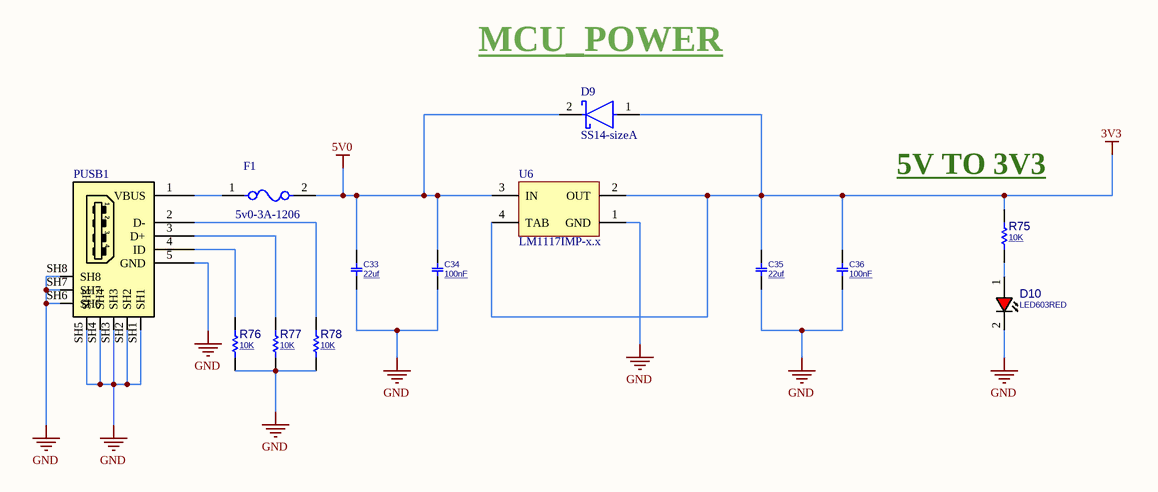
[diagram p10: AMS1117-3.3V.SchDoc]

### Parts
C33  22uf  [C1206]
C34  100nF  [C0603]
C35  22uf  [C1206]
C36  100nF  [C0603]
D9  SS14-sizeA  [FP-403AE-MFG]
D10  LED603RED  [LED0603RED]
F1  5v0-3A-1206  [FP-nanoSMDC-MFG]
PUSB1  CONN_USB_MICROB  [USB_MICRO_B_BM_SHS]  (value not drawn)
R75  10K  [R0603]
R76  10K  [R0603]
R77  10K  [R0603]
R78  10K  [R0603]
U6  LM1117IMP-x.x  [SOT223]

### Nets
3V3: C35.2 C36.2 D9.1(A) R75.1 U6.2(OUT) U6.4(TAB)
5V0: C33.2 C34.2 D9.2(C) F1.2 U6.3(IN)
GND: C33.1 C34.1 C35.1 C36.1 D10.2(CATHODE) PUSB1.5(GND) PUSB1.SH1 PUSB1.SH2 PUSB1.SH3 PUSB1.SH4 PUSB1.SH5 PUSB1.SH6 PUSB1.SH7 PUSB1.SH8 R76.2 R77.2 R78.2 U6.1(GND)
NetD10_1: D10.1(ANODE) R75.2
NetF1_1: F1.1 PUSB1.1(VBUS)
NetPUSB1_2: PUSB1.2(D-) R78.1
NetPUSB1_3: PUSB1.3(D+) R77.1
NetPUSB1_4: PUSB1.4(ID) R76.1

### Notes on the sheet
- MCU_POWER
- (near R75) 5V TO 3V3

### Library data of the parts
C33 C35 = CAP_SMD_MLCC_1206: as C2 on sheet Xpt2046; PRICE: 100= 1$; MANF: -; PARAM2: -V; ASSEMBLY: ASSEMBLY; VALUE: 22uf
C34 C36 = CAP_SMD_MLCC_0603: as C1 on sheet ili9341-SpiLcd; PRICE: 100= 1$; MANF: -; PARAM2: -V; ASSEMBLY: ASSEMBLY; VALUE: 100nF
D9 = ss14: DIODE SCHOTTKY 40V 1A SMA; Manufacturer: ON Semiconductor; Peak Reverse Current: 0.2mA; Max Junction Temp: +125°C; Standoff Height: 0.05mm; Max Surge Forward Current: 40A; Mouser Description: Schottky Diodes & Rectifiers SMA 40V 1.0A; RoHS: TRUE; Lead Free: Yes; Manufacturer Part Number: SS14; Device Class L3: Schottky Diodes; Category: Diode; Automotive: No; Digikey Description: DIODE SCHOTTKY 40V 1A SMA; ComponentLink2Description: Datasheet; Device Class L2: Diodes; Height: 2.5mm; Temperature Range High: +125°C; ComponentLink2URL: https://www.onsemi.com/pub/Collateral/SS19-D.PDF; Device Class L1: Discrete Semiconductors; Package: 403AE; Octopart: https://octopart.com/ss14-on+semiconductor-29205033; Max Repetitive Reverse Voltage: 40V; Temperature Range Low: -65°C; Forward Current: 1A; Temperature: -65°C to +125°C
D10 = LED_SMD_0603_RED: as D1 on sheet Xpt2046; MANF: MANF; ASSEMBLY: ASSEMBLY; PRICE: PRICE; VALUE: LED603RED
F1 = CMP-08606-000049-1: PTC RESET FUSE 48V 120MA 1206; Manufacturer: Littelfuse; Manufacturer Part Number: NANOSMDC012F-2; Trip Current: 0.39A; Resistance: 1.4-6.5Ω; Value: 1.4-6.5Ω; Current Rating: 10A; Hold Current: 0.12A; Trip Time: 0.2s; Category: Fuse; Device Class L2: PTC Resettable Fuses; ComponentLink2Description: Datasheet; Automotive: No; Package: nanoSMDC; Ambient Temperature Range Low: -40°C; Lead Free: Yes; Voltage Rating: 48V; Mouser Description: PTC Resettable Fuse 0.12A(hold) 0.39A(trip) 48VDC 10A 0.5W 0.2s 1.4Ohm SMD Solder Pad 1206 T/R Automotive; Octopart: https://octopart.com/nanosmdc012f-2-littelfuse-74215047; Device Class L1: Circuit Protection; Temperature Range High: +85°C; ComponentLink2URL: https://www.littelfuse.com/~/media/electronics/datasheets/resettable_ptcs/littelfuse_ptc_nanosmdc_datasheet.pdf.pdf; Temperature: to +85°C; Height: 1mm; Ambient Temperature Range High: +85°C; Digikey Description: PTC RESET FUSE 48V 120MA 1206; Device Class L3: unset; RoHS: TRUE
PUSB1 = CONN_USB_MICRO_B_BM_SHS: CONN, USB, MICRO B, R/A, SMD, BOTTOM MOUNT; MANF_P#: 47346-0001; MANF: Molex; MANF_P#2: HIROSE ZX62-AB-5PA; PARAM2: 30VAC; PARAM: 1.8A, -20~85oC; PRICE: 0.75$; VALUE: CONN_USB_MICROB
R75-R78 = RES_SMD: as R1 on sheet ili9341-SpiLcd; MANF_P#: -; MANF: -; ASSEMBLY: ASSEMBLY; PRICE: 100= 0.5$; VALUE: 10K
U6 = LM1117IMP-x.x: x.x Volt, 800mA Low-Dropout Linear Regulator, 4-pin SOT-223; ComponentLink1Description: Website: Tarahiboard; ComponentLink1URL: https://www.tarahiboard.com/; ComponentLink2Description: Telegram; ComponentLink2URL: https://t.me/tarahiboard; ComponentLink3Description: Instagram; ComponentLink3URL: https://instagram.com/tarahiboard; DatasheetVersion: 2021

## Sheet PCF8547.SchDoc
size A; SheetNumber: 12; SheetTotal: 12
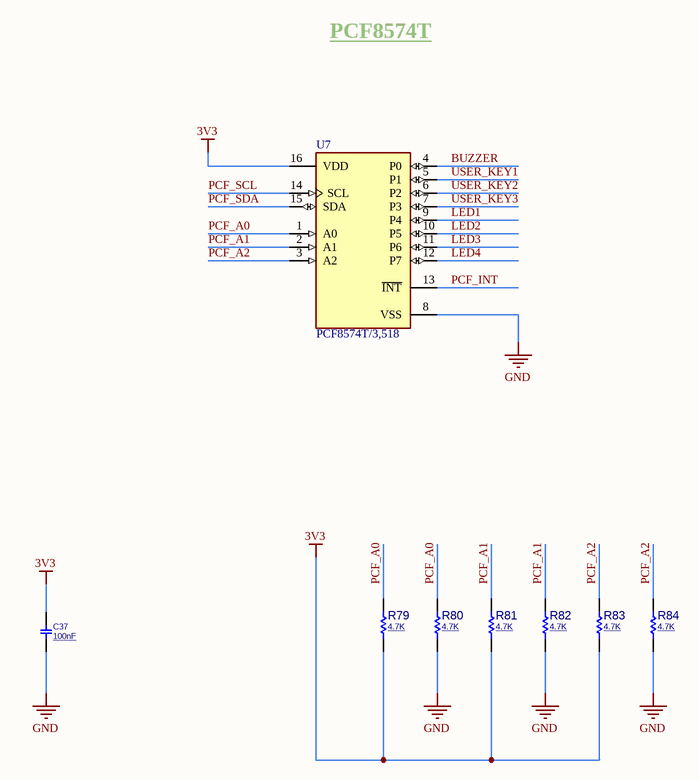
[diagram p11: PCF8547.SchDoc]

### Parts
C37  100nF  [C0603]
R79  4.7K  [R0603]
R80  4.7K  [R0603]
R81  4.7K  [R0603]
R82  4.7K  [R0603]
R83  4.7K  [R0603]
R84  4.7K  [R0603]
U7  PCF8574T/3,518  [FP-SOT162-1-MFG]

### Nets
3V3: C37.2 R79.2 R81.2 R83.2 U7.16(VDD)
GND: C37.1 R80.2 R82.2 R84.2 U7.8(VSS)
BUZZER: U7.4(P0)
LED1: U7.9(P4)
LED2: U7.10(P5)
LED3: U7.11(P6)
LED4: U7.12(P7)
PCF_A0: R79.1 R80.1 U7.1(A0)
PCF_A1: R81.1 R82.1 U7.2(A1)
PCF_A2: R83.1 R84.1 U7.3(A2)
PCF_INT: U7.13(~{INT})
PCF_SCL: U7.14(SCL)  [project net EE_scl]
PCF_SDA: U7.15(SDA)  [project net EE_sda]
USER_KEY1: U7.5(P1)
USER_KEY2: U7.6(P2)
USER_KEY3: U7.7(P3)

### Notes on the sheet
- PCF8574T

### Library data of the parts
C37 = CAP_SMD_MLCC_0603: as C1 on sheet ili9341-SpiLcd; PRICE: 100= 1$; MANF: -; PARAM2: -V; ASSEMBLY: ASSEMBLY; VALUE: 100nF
R79-R84 = RES_SMD: as R1 on sheet ili9341-SpiLcd; MANF_P#: -; MANF: -; ASSEMBLY: ASSEMBLY; PRICE: 100= 0.5$; VALUE: 4.7K
U7 = PCF8574T: IC I/O EXPANDER I2C 8B 16SOIC; Manufacturer: NXP Semiconductors; Frequency: 100kHz; Max Supply Voltage: 6V; Standoff Height: 0.1mm; Nominal Supply Current: 40uA; Max Junction Temp: +125°C; Min Supply Voltage: 2.5V; Number Of I/Os: 8; Manufacturer Part Number: PCF8574T/3,518; Footprint Url: https://www.nxp.com/docs/en/package-information/SOT162-1.pdf; ComponentLink2URL: https://www.nxp.com/docs/en/data-sheet/PCF8574_PCF8574A.pdf; Automotive: No; Digikey Description: IC I/O EXPANDER I2C 8B 16SOIC; Mouser Description: PCF8574 Series 2.5 - 6V Remote 8-bit I/O Expander for I2C-bus - SOIC-16; Ipc Land Pattern Name: SOIC127P1032X265-16; Interface: I2C; Octopart: https://octopart.com/pcf8574t%2F3%2C518-nxp+semiconductors-10470852; Ambient Temperature Range Low: -40°C; Lead Free: Yes; Device Class L2: Interface ICs; Temperature Range High: +85°C; Device Class L1: Integrated Circuits (ICs); Package: SOT162-1; ComponentLink2Description: Datasheet; Device Class L3: I/O Expanders; Temperature: -40°C to +85°C; Ambient Temperature Range High: +85°C; Height: 2.65mm; Category: IC; RoHS: TRUE; Temperature Range Low: -40°C

## Nets that join several sheets
3V3: ili9341-SpiLcd (8 pins), Xpt2046 (8 pins), W25Qxx-SpiFlash (5 pins), SDIO_SDcard (9 pins), AT24Cxxx_EEPROM_I2C (C7.2 R30.2 R31.2 U3.8), ESP8266-12x (8 pins), HC-05_BlueTooth (5 pins), Key_LED_Buzzer (9 pins), Stm32F411CEU6 (J7.1), Stm32F411CEU6_Property (D8.1 L1.1 R73.2), AMS1117-3.3V (6 pins), PCF8547 (5 pins)
5V0: ili9341-SpiLcd (j1.1), AMS1117-3.3V (5 pins)
AGND: Stm32F411CEU6 (U5.8), Stm32F411CEU6_Property (C25.2 C26.1 L3.2)
ANALOG_3V3: Stm32F411CEU6 (U5.9), Stm32F411CEU6_Property (C25.1 C26.2 L2.2)
GND: ili9341-SpiLcd (8 pins), Xpt2046 (6 pins), W25Qxx-SpiFlash (C5.1 U2.4), SDIO_SDcard (6 pins), AT24Cxxx_EEPROM_I2C (6 pins), ESP8266-12x (12 pins), HC-05_BlueTooth (9 pins), Key_LED_Buzzer (16 pins), Stm32F411CEU6 (5 pins), Stm32F411CEU6_Property (20 pins), AMS1117-3.3V (18 pins), PCF8547 (5 pins)
MCU_3V3: Stm32F411CEU6 (U5.24 U5.36 U5.48), Stm32F411CEU6_Property (8 pins)
MCU_VBAT: Stm32F411CEU6 (U5.1), Stm32F411CEU6_Property (C31.1 C32.2 D8.3)
BUZZER: Key_LED_Buzzer (R70.2), PCF8547 (U7.4)
EE_scl: AT24Cxxx_EEPROM_I2C (R31.1 U3.6), Stm32F411CEU6 (U5.45), PCF8547 (U7.14)
EE_sda: AT24Cxxx_EEPROM_I2C (R30.1 U3.5), Stm32F411CEU6 (U5.46), PCF8547 (U7.15)
ESP_EN: ESP8266-12x (R36.1), Stm32F411CEU6 (U5.2)
ESP_RST: ESP8266-12x (R42.1), Stm32F411CEU6 (U5.42)
ESP_RX: ESP8266-12x (U4.21), Stm32F411CEU6 (U5.38)
ESP_TX: ESP8266-12x (U4.22), Stm32F411CEU6 (U5.39)
HC05_ON_OFF: HC-05_BlueTooth (R49.1), Stm32F411CEU6 (U5.25)
HC05_RX: HC-05_BlueTooth (HC1.2), Stm32F411CEU6 (U5.12)
HC05_TX: HC-05_BlueTooth (HC1.1), Stm32F411CEU6 (U5.13)
LCD_BKL: ili9341-SpiLcd (R22.2), Stm32F411CEU6 (U5.32)
LCD_CLK: ili9341-SpiLcd (LCD1.3), Stm32F411CEU6 (U5.18)
LCD_CS: ili9341-SpiLcd (LCD1.5), Stm32F411CEU6 (U5.19)
LCD_DC: ili9341-SpiLcd (LCD1.4), Stm32F411CEU6 (U5.20)
LCD_MISO: ili9341-SpiLcd (LCD1.6), Stm32F411CEU6 (U5.33)
LCD_MOSI: ili9341-SpiLcd (LCD1.7), Stm32F411CEU6 (U5.31)
LCD_RES: ili9341-SpiLcd (LCD1.2), Stm32F411CEU6 (U5.21)
LED1: Key_LED_Buzzer (R58.2), PCF8547 (U7.9)
LED2: Key_LED_Buzzer (R55.2), PCF8547 (U7.10)
LED3: Key_LED_Buzzer (R56.2), PCF8547 (U7.11)
LED4: Key_LED_Buzzer (R57.2), PCF8547 (U7.12)
MCU_BOOT0: Stm32F411CEU6 (U5.44), Stm32F411CEU6_Property (R74.2)
MCU_NRST: Stm32F411CEU6 (U5.7), Stm32F411CEU6_Property (C29.2 R73.1 SW5.2)
MCU_OSC32_IN: Stm32F411CEU6 (U5.3), Stm32F411CEU6_Property (C27.1 Y2.1)
MCU_OSC32_OUT: Stm32F411CEU6 (U5.4), Stm32F411CEU6_Property (C28.1 Y2.4)
MCU_OSC_IN: Stm32F411CEU6 (U5.5), Stm32F411CEU6_Property (C24.1 Y1.1)
MCU_OSC_OUT: Stm32F411CEU6 (U5.6), Stm32F411CEU6_Property (C17.1 Y1.2)
PCF_INT: Stm32F411CEU6 (U5.10), PCF8547 (U7.13)
SDCARD_STATE: SDIO_SDcard (J2.9 RA1.4), Stm32F411CEU6 (U5.27)
SDIO_CLK: SDIO_SDcard (J2.5 RA2.1), Stm32F411CEU6 (U5.28)
SDIO_CMD: SDIO_SDcard (J2.3 RA1.3), Stm32F411CEU6 (U5.16)
SDIO_D0: SDIO_SDcard (J2.7 RA2.2), Stm32F411CEU6 (U5.43)
SDIO_D1: SDIO_SDcard (J2.8 RA2.3), Stm32F411CEU6 (U5.29)
SDIO_D2: SDIO_SDcard (J2.1 RA1.1), Stm32F411CEU6 (U5.30)
SDIO_D3: SDIO_SDcard (J2.2 RA1.2), Stm32F411CEU6 (U5.41)
USER_KEY1: Key_LED_Buzzer (C14.2 R67.2 SW2.2), PCF8547 (U7.5)
USER_KEY2: Key_LED_Buzzer (C15.2 R68.2 SW3.2), PCF8547 (U7.6)
USER_KEY3: Key_LED_Buzzer (C16.2 R69.2 SW4.2), PCF8547 (U7.7)
VCAP1: Stm32F411CEU6 (U5.22), Stm32F411CEU6_Property (C30.2)
W25Q_CLK: Xpt2046 (U1.16), W25Qxx-SpiFlash (U2.6), Stm32F411CEU6 (U5.15)
W25Q_CS: W25Qxx-SpiFlash (R29.1 U2.1), Stm32F411CEU6 (U5.26)
W25Q_MISO: Xpt2046 (U1.12), W25Qxx-SpiFlash (U2.2), Stm32F411CEU6 (U5.40)
W25Q_MOSI: Xpt2046 (U1.14), W25Qxx-SpiFlash (U2.5), Stm32F411CEU6 (U5.17)
XN: ili9341-SpiLcd (LCD1.15), Xpt2046 (U1.4)
XP: ili9341-SpiLcd (LCD1.17), Xpt2046 (U1.2)
XPT2046_CS: Xpt2046 (U1.15), Stm32F411CEU6 (U5.11)
XPT2046_IRQ: Xpt2046 (R23.1 U1.11), Stm32F411CEU6 (U5.14)
YN: ili9341-SpiLcd (LCD1.16), Xpt2046 (U1.5)
YP: ili9341-SpiLcd (LCD1.18), Xpt2046 (U1.3)